# EAGLE schematic mordomusesp8266 (EAGLE 9.4.2)
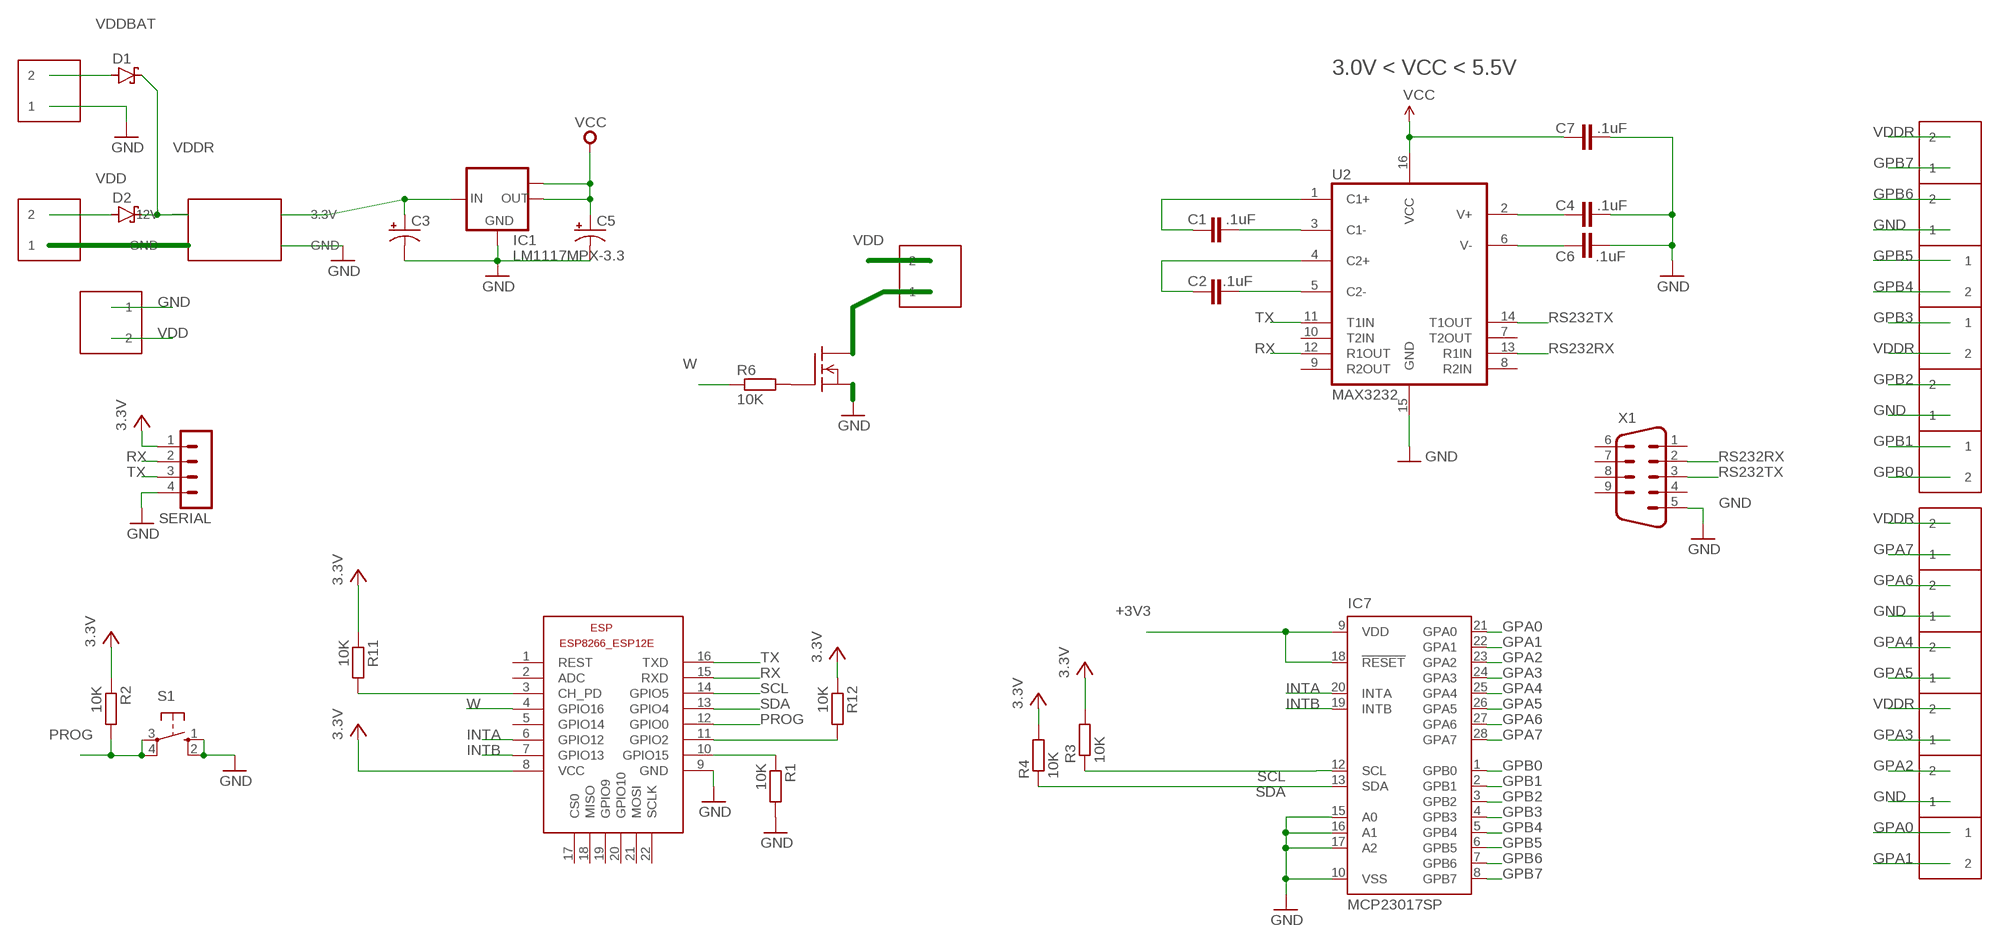
[diagram p0: schematic, sheet 1]

## Parts
C1  .1uF  0.1UF-25V(+80/-20%)(0603)  [0603-CAP]
C2  .1uF  0.1UF-25V(+80/-20%)(0603)  [0603-CAP]
C3  100UF-25V-20%(PTH)  [CPOL-RADIAL-100UF-25V]
C4  .1uF  0.1UF-25V(+80/-20%)(0603)  [0603-CAP]
C5  100UF-25V-20%(PTH)  [CPOL-RADIAL-100UF-25V]
C6  .1uF  0.1UF-25V(+80/-20%)(0603)  [0603-CAP]
C7  .1uF  0.1UF-25V(+80/-20%)(0603)  [0603-CAP]
D1  SCHOTTKY-DIODESMC  [SMC]
D2  SCHOTTKY-DIODESMC  [SMC]
ESP  ESP8266-12EESP8266-ESP12E  [ESP8266-ESP12E]
G  FDS5680  [SO-8]
IC1  LM1117MPX-3.3  [SOT223]
IC7  MCP23017SP  [DIL28-3]
PWR1  MP2307-MINI-360  [MP2307-MINI-360]
PWR_IN  KF350-P2  [KF350-2P]
PWR_IN1  KF350-P2  [KF350-2P]
PWR_IN2  KF350-P2  [KF350-2P]
PWR_IN3  KF350-P2  [KF350-2P]
PWR_IN4  KF350-P2  [KF350-2P]
PWR_IN5  KF350-P2  [KF350-2P]
PWR_IN6  KF350-P2  [KF350-2P]
PWR_IN7  KF350-P2  [KF350-2P]
PWR_IN8  KF350-P2  [KF350-2P]
PWR_IN9  KF350-P2  [KF350-2P]
PWR_IN10  KF350-P2  [KF350-2P]
PWR_IN11  KF350-P2  [KF350-2P]
PWR_IN12  KF350-P2  [KF350-2P]
PWR_IN13  KF350-P2  [KF350-2P]
PWR_IN14  KF350-P2  [KF350-2P]
PWR_INBAT  KF350-P2  [KF350-2P]
R1  10K  R-EU_R0603  [R0603]
R2  10K  R-EU_R0603  [R0603]
R3  10K  R-EU_R0603  [R0603]
R4  10K  R-EU_R0603  [R0603]
R6  10K  R-EU_R0603  [R0603]
R11  10K  R-EU_R0603  [R0603]
R12  10K  R-EU_R0603  [R0603]
S1  10-XX  [B3F-10XX]
SERIAL  MA04-1  [MA04-1]
U2  MAX3232  MAX232SOIC16  [SO016]
X1  M09HP  [M09HP]

## Nets
+3V3: C5.1(+) C7.1 ESP.8(VCC) IC1.2(OUT) IC1.TAB(OUT1) IC7.9(VDD) IC7.18(!RESET) R2.1 R3.2 R4.2 R11.1 R12.1 SERIAL.1 U2.16(VCC) ; supply symbol labelled VCC, 3.3V
C1+: C1.1 U2.1(C1+)
C1-: C1.2 U2.3(C1-)
C2+: C2.1 U2.4(C2+)
C2-: C2.2 U2.5(C2-)
DG: G.5(D) G.6(D) G.7(D) G.8(D) PWR_IN1.1
GND: C3.2(-) C4.2 C5.2(-) C6.2 C7.2 ESP.9(GND) G.1(S) G.2(S) G.3(S) IC1.1(GND) IC7.10(VSS) IC7.15(A0) IC7.16(A1) IC7.17(A2) PWR1.GND@1(GND) PWR1.GND@2(GND) PWR_IN2.1 PWR_IN5.1 PWR_IN8.1 PWR_IN12.1 PWR_IN14.1 PWR_IN.1 PWR_INBAT.1 R1.2 S1.1(S) S1.2(S1) SERIAL.4 U2.15(GND) X1.5
GPA0: IC7.21(GPA0) PWR_IN11.1
GPA1: IC7.22(GPA1) PWR_IN11.2
GPA2: IC7.23(GPA2) PWR_IN12.2
GPA3: IC7.24(GPA3) PWR_IN13.1
GPA4: IC7.25(GPA4) PWR_IN3.2
GPA5: IC7.26(GPA5) PWR_IN3.1
GPA6: IC7.27(GPA6) PWR_IN2.2
GPA7: IC7.28(GPA7) PWR_IN10.1
GPB0: IC7.1(GPB0) PWR_IN6.2
GPB1: IC7.2(GPB1) PWR_IN6.1
GPB2: IC7.3(GPB2) PWR_IN5.2
GPB3: IC7.4(GPB3) PWR_IN7.1
GPB4: IC7.5(GPB4) PWR_IN9.2
GPB5: IC7.6(GPB5) PWR_IN9.1
GPB6: IC7.7(GPB6) PWR_IN8.2
GPB7: IC7.8(GPB7) PWR_IN4.1
INTA: ESP.6(GPIO12) IC7.20(INTA)
INTB: ESP.7(GPIO13) IC7.19(INTB)
N$2: ESP.10(GPIO15) R1.1
N$3: ESP.3(CH_PD) R11.2
N$4: ESP.11(GPIO2) R12.2
N$5: G.4(G) R6.2
PROG: ESP.12(GPIO0) R2.2 S1.3(P) S1.4(P1)
RS232RX: U2.13(R1IN) X1.2
RS232TX: U2.14(T1OUT) X1.3
RVCC: C3.1(+) IC1.3(IN) PWR1.3.3V
RX: ESP.15(RXD) SERIAL.2 U2.12(R1OUT)
SCL: ESP.14(GPIO5) IC7.12(SCL) R3.1
SDA: ESP.13(GPIO4) IC7.13(SDA) R4.1
TX: ESP.16(TXD) SERIAL.3 U2.11(T1IN)
V+: C4.1 U2.2(V+)
V-: C6.1 U2.6(V-)
VDD: D2.A PWR_IN1.2 PWR_IN14.2 PWR_IN.2
VDDBAT: D1.A PWR_INBAT.2
VDDR: D1.C D2.C PWR1.12V PWR_IN4.2 PWR_IN7.2 PWR_IN10.2 PWR_IN13.2
W: ESP.4(GPIO16) R6.1
Unconnected: ESP.1(REST) ESP.2(ADC) ESP.5(GPIO14) ESP.17(CS0) ESP.18(MISO) ESP.19(GPIO9) ESP.20(GPIO10) ESP.21(MOSI) ESP.22(SCLK) U2.7(T2OUT) U2.8(R2IN) U2.9(R2OUT) U2.10(T2IN) X1.1 X1.4 X1.6 X1.7 X1.8 X1.9

## Notes on the sheet
- 3.0V < VCC < 5.5V

## Library data of the parts
C1 C2 C4 C6 C7 = SparkFun-Capacitors:0.1UF-25V(+80/-20%)(0603): CAP-00810 Ceramic Standard decoupling cap; PROD_ID: CAP-00810; SPARKLE_ID: 918; VALUE: 0.1uF
C3 C5 = SparkFun-Capacitors:100UF-25V-20%(PTH): CAP-08439; PROD_ID: CAP-08439
D1 D2 = diode:SCHOTTKY-DIODE: Schottky Diode
ESP = ESP8266-ESP12E:ESP8266-12E: ESP8266-12E with additional I/O and GPIO04/05 corrected The author cannot warrant that this library is free from error or will meet your specific requirements. Created by PuceBaboon.com. Komagane, Nagano, JAPAN
G = transistor-fet:FDS5680: 60V N-Channel PowerTrench TM MOSFET FAIRCHILD FDS5680.pdf
IC1 = lm1117:LM1117MPX-*
IC7 = microchip-6:MCP23017: http://ww1.microchip.com/downloads/en/DeviceDoc/21952a.pdf Source: http://ww1.microchip.com/downloads/en/DeviceDoc/21952a.pdf
PWR1 = MP2307-MINI-360:MP2307-MINI-360
PWR_IN PWR_IN1-PWR_IN14 PWR_INBAT = KF350-P2:KF350-P2
R1-R4 R6 R11 R12 = resistor:R-EU_: RESISTOR, European symbol
S1 = switch-omron:10-XX: OMRON SWITCH; MPN: B3F-1000; OC_FARNELL: 176432; OC_NEWARK: 36M3542
SERIAL = con-lstb:MA04-1: PIN HEADER; OC_FARNELL: unknown; OC_NEWARK: unknown
U2 = SparkFun-DigitalIC:MAX232: RS232 Transceiver Very common IC. This is generically called 'MAX232', but works with the 3V equivalent MAX3232 generic ICs. Field tested and mother approved. Spark Fun Electronics SKU : COM-00316 (DIP) and COM-00589 (SMD); PROD_ID: IC-08171
X1 = con-subd:M09: HARTING SUB-D

## Net classes
1 +3v3: width 0.406 mm
2 GND: width 0.406 mm